# EAGLE design board (EAGLE 9.6.2)
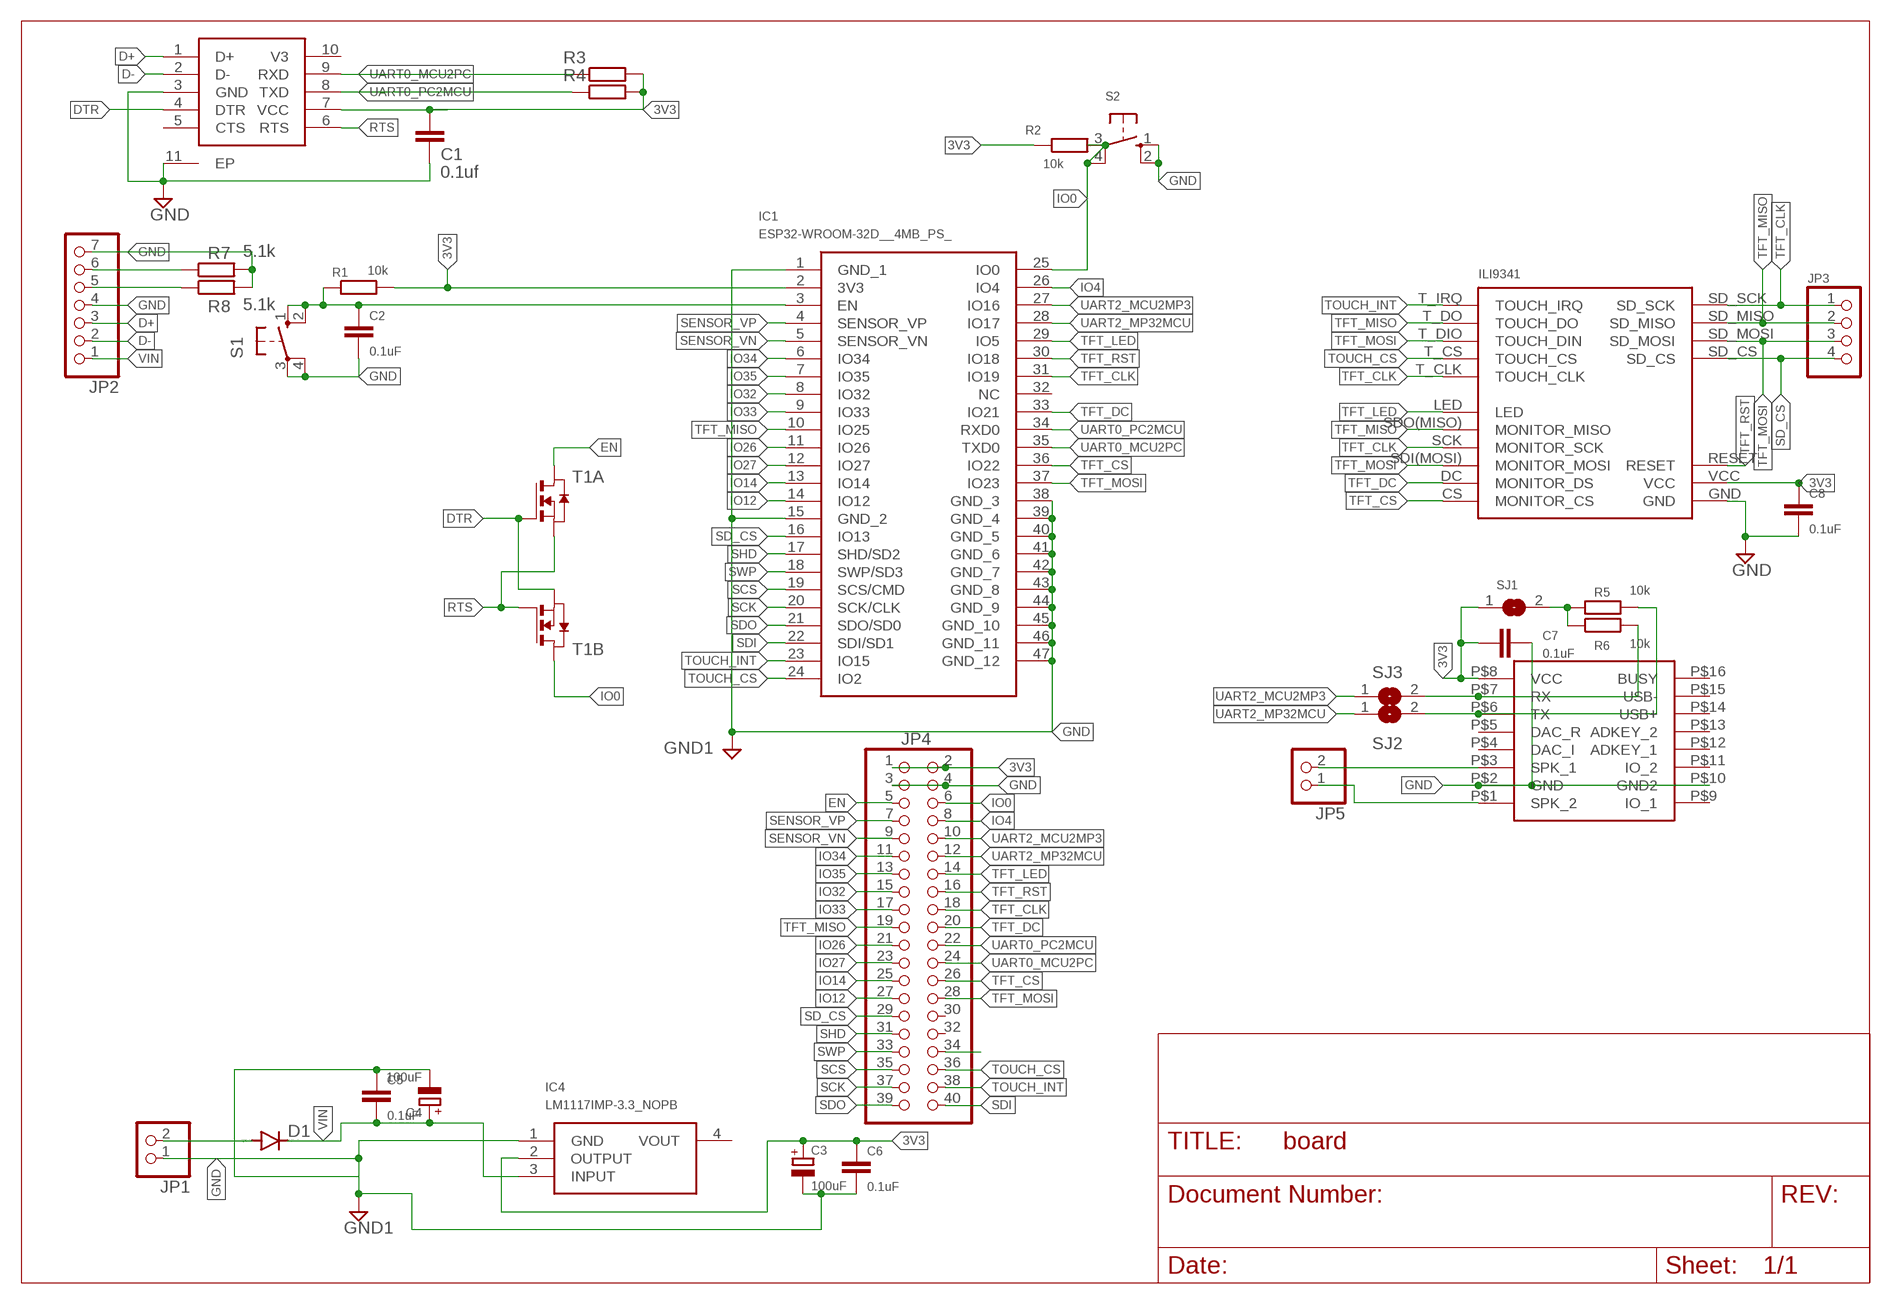
[diagram p0: schematic, sheet 1]

## Parts
C1  0.1uf  C-EUC1206  [C1206]
C2  0.1uF  C-EUC1206  [C1206]
C3  100uF  CPOL-EUE2.5-7  [E2,5-7]
C4  100uF  CPOL-EUE2.5-7  [E2,5-7]
C5  0.1uF  C-EUC1206  [C1206]
C6  0.1uF  C-EUC1206  [C1206]
C7  0.1uF  C-EUC1206  [C1206]
C8  0.1uF  C-EUC1206  [C1206]
D1  DIODE-SOD123  [SOD123]
IC1  ESP32-WROOM-32D__4MB_PS_  [ESP32WROOM32D4MBPS]
IC3  CH340K  [SOP100P600X150-11T240X280N]
IC4  LM1117IMP-3.3_NOPB  [SOT230P700X180-4N]
JP1  PINHD-1X2  [1X02]
JP2  PINHD-1X7  [1X07]
JP3  PINHD-1X4  [1X04]
JP4  PINHD-2X20  [2X20]
JP5  PINHD-1X2  [1X02]
R1  10k  R-EU_M1206  [M1206]
R2  10k  R-EU_M1206  [M1206]
R3  R-EU_M1206  [M1206]
R4  R-EU_M1206  [M1206]
R5  10k  R-EU_M1206  [M1206]
R6  10k  R-EU_M1206  [M1206]
R7  5.1k  R-EU_M1206  [M1206]
R8  5.1k  R-EU_M1206  [M1206]
S1  10-XX  [B3F-10XX]
S2  10-XX  [B3F-10XX]
SJ1  SJ  [SJ]
SJ2  SJ  [SJ]
SJ3  SJ  [SJ]
T1  NMOS2SO8  [SO8]
U$1  ILI9341_MODULE1  [ILI9341_MODULE1]
U$2  DFPLAYER_MINI  [DFPLAYER_MINI]

## Nets
3V3 [POWER]: C1.1 C3.+ C6.1 C7.1 C8.1 IC1.2(3V3) IC3.7(VCC) IC4.2(OUTPUT) JP4.1 JP4.2 R1.2 R2.1 R3.2 R4.2 SJ1.1 U$1.VCC U$2.P$8(VCC)
D+: IC3.1(D+) JP2.3
D-: IC3.2(D-) JP2.2
DTR: IC3.4(DTR) T1.2(A:G) T1.3(B:S)
EN: C2.1 IC1.3(EN) JP4.5 R1.1 S1.1(S) S1.2(S1) T1.7(A:D) T1.8(A:D)
GND [POWER]: C1.2 C2.2 C3.- C4.- C5.1 C6.2 C7.2 C8.2 IC1.1(GND_1) IC1.15(GND_2) IC1.38(GND_3) IC1.39(GND_4) IC1.40(GND_5) IC1.41(GND_6) IC1.42(GND_7) IC1.43(GND_8) IC1.44(GND_9) IC1.45(GND_10) IC1.46(GND_11) IC1.47(GND_12) IC3.3(GND) IC3.11(EP) IC4.1(GND) JP1.1 JP2.4 JP2.7 JP4.3 JP4.4 R7.2 R8.2 S1.3(P) S1.4(P1) S2.1(S) S2.2(S1) U$1.GND U$2.P$2(GND) U$2.P$10(GND2) ; supply symbol labelled GND1
IO0: IC1.25(IO0) JP4.6 JP4.34 R2.2 S2.3(P) S2.4(P1) T1.5(B:D) T1.6(B:D)
IO4: IC1.26(IO4) JP4.8
IO12: IC1.14(IO12) JP4.27
IO14: IC1.13(IO14) JP4.25
IO26: IC1.11(IO26) JP4.21
IO27: IC1.12(IO27) JP4.23
IO32: IC1.8(IO32) JP4.15
IO33: IC1.9(IO33) JP4.17
IO34: IC1.6(IO34) JP4.11
IO35: IC1.7(IO35) JP4.13
MP3_RX: R6.2 SJ3.2 U$2.P$7(RX)
MP3_TX: R5.2 SJ2.2 U$2.P$6(TX)
N$5: JP5.2 U$2.P$3(SPK_1)
N$6 [POWER]: D1.A JP1.2
N$7: JP2.6 R7.1
N$8: JP2.5 R8.1
N$9 [POWER]: R5.1 R6.1 SJ1.2
RTS: IC3.6(RTS) T1.1(A:S) T1.4(B:G)
SCK: IC1.20(SCK/CLK) JP4.37
SCS: IC1.19(SCS/CMD) JP4.35
SD_CS: IC1.16(IO13) JP3.4 JP4.29 U$1.SD_CS
SDI: IC1.22(SDI/SD1) JP4.40
SDO: IC1.21(SDO/SD0) JP4.39
SENSOR_VN: IC1.5(SENSOR_VN) JP4.9
SENSOR_VP: IC1.4(SENSOR_VP) JP4.7
SHD: IC1.17(SHD/SD2) JP4.31
SPK2: JP5.1 U$2.P$1(SPK_2)
SWP: IC1.18(SWP/SD3) JP4.33
TFT_CLK: IC1.31(IO19) JP3.1 JP4.18 U$1.SCK(MONITOR_SCK) U$1.SD_SCK U$1.T_CLK(TOUCH_CLK)
TFT_CS: IC1.36(IO22) JP4.26 U$1.CS(MONITOR_CS)
TFT_DC: IC1.33(IO21) JP4.20 U$1.DC(MONITOR_DS)
TFT_LED: IC1.29(IO5) JP4.14 U$1.LED
TFT_MISO: IC1.10(IO25) JP3.2 JP4.19 U$1.SD_MISO U$1.SDO(MISO)(MONITOR_MISO) U$1.T_DO(TOUCH_DO)
TFT_MOSI: IC1.37(IO23) JP3.3 JP4.28 U$1.SD_MOSI U$1.SDI(MOSI)(MONITOR_MOSI) U$1.T_DIO(TOUCH_DIN)
TFT_RST: IC1.30(IO18) JP4.16 U$1.RESET
TOUCH_CS: IC1.24(IO2) JP4.36 U$1.T_CS(TOUCH_CS)
TOUCH_INT: IC1.23(IO15) JP4.38 U$1.T_IRQ(TOUCH_IRQ)
UART0_MCU2PC: IC1.35(TXD0) IC3.9(RXD) JP4.24 R3.1
UART0_PC2MCU: IC1.34(RXD0) IC3.8(TXD) JP4.22 R4.1
UART2_MCU2MP3: IC1.27(IO16) JP4.10 SJ3.1
UART2_MP32MCU: IC1.28(IO17) JP4.12 SJ2.1
VIN [POWER]: C4.+ C5.2 D1.C IC4.3(INPUT) JP2.1
Unconnected: IC1.32(NC) IC3.5(CTS) IC3.10(V3) IC4.4(VOUT) JP4.30 JP4.32 U$2.P$4(DAC_I) U$2.P$5(DAC_R) U$2.P$9(IO_1) U$2.P$11(IO_2) U$2.P$12(ADKEY_1) U$2.P$13(ADKEY_2) U$2.P$14(USB+) U$2.P$15(USB-) U$2.P$16(BUSY)

## Library data of the parts
C1 C2 C5-C8 = rcl:C-EU: CAPACITOR, European symbol; SPICEPREFIX: C
C3 C4 = rcl:CPOL-EU: POLARIZED CAPACITOR, European symbol; SPICEPREFIX: C
D1 = diode:DIODE-: DIODE
IC1 = SamacSys_Parts:ESP32-WROOM-32D__4MB_PS_: WiFi Modules (802.11) Source: Datasheet; DESCRIPTION: WiFi Modules (802.11); HEIGHT: 3.2mm; MANUFACTURER_NAME: Espressif Systems; MANUFACTURER_PART_NUMBER: ESP32-WROOM-32D (4MB PS); MOUSER_PART_NUMBER: 356-ESPWROOM3200PS3; MOUSER_PRICE-STOCK: https://www.mouser.co.uk/ProductDetail/Espressif-Systems/ESP32-WROOM-32D-4MB-PS?qs=GBLSl2Akirs5uooPY1MBgw%3D%3D
IC3 = myparts:CH340K: USB-UART chip with DTR, CTS, RTS pin
IC4 = SamacSys_Parts:LM1117IMP-3.3_NOPB: LM1117IMP-3.3/NOPB, Low Dropout Voltage Regulator, 1.5A, 3.3 V +/-1%, 4-Pin SOT-223 Source: Datasheet <https://www.ti.com/lit/ds/symlink/lm1117.pdf?ts=1607578196475&ref_url=https%3A%2F%2Fwww.google.com%2F>; ARROW_PART_NUMBER: LM1117IMP-3.3/NOPB; ARROW_PRICE-STOCK: https://www.arrow.com/en/products/lm1117imp-3.3nopb/texas-instruments?region=nac; DESCRIPTION: LM1117IMP-3.3/NOPB, Low Dropout Voltage Regulator, 1.5A, 3.3 V +/-1%, 4-Pin SOT-223; HEIGHT: 1.8mm; MANUFACTURER_NAME: Texas Instruments; MANUFACTURER_PART_NUMBER: LM1117IMP-3.3/NOPB; MOUSER_PART_NUMBER: 926-LM1117IMP3.3NOPB; MOUSER_PRICE-STOCK: https://www.mouser.co.uk/ProductDetail/Texas-Instruments/LM1117IMP-33-NOPB?qs=X1J7HmVL2ZFbpN1TgOsjYQ%3D%3D
JP1 JP5 = pinhead:PINHD-1X2: PIN HEADER
JP2 = pinhead:PINHD-1X7: PIN HEADER
JP3 = pinhead:PINHD-1X4: PIN HEADER
JP4 = pinhead:PINHD-2X20: PIN HEADER
R1-R8 = rcl:R-EU_: RESISTOR, European symbol; SPICEPREFIX: R
S1 S2 = switch-omron:10-XX: OMRON SWITCH; MPN: B3F-1000; OC_FARNELL: 176432; OC_NEWARK: 36M3542
SJ1-SJ3 = jumper:SJ: SMD solder JUMPER
T1 = zetex:NMOS2: Dual MOS FET; OC_FARNELL: unknown; OC_NEWARK: unknown
U$1 = myparts:ILI9341_MODULE1
U$2 = myparts:DFPLAYER_MINI

## Net classes
0 default: width 0.254 mm, clearance 0.203 mm
1 POWER: width 0.762 mm, clearance 0.203 mm

## Board
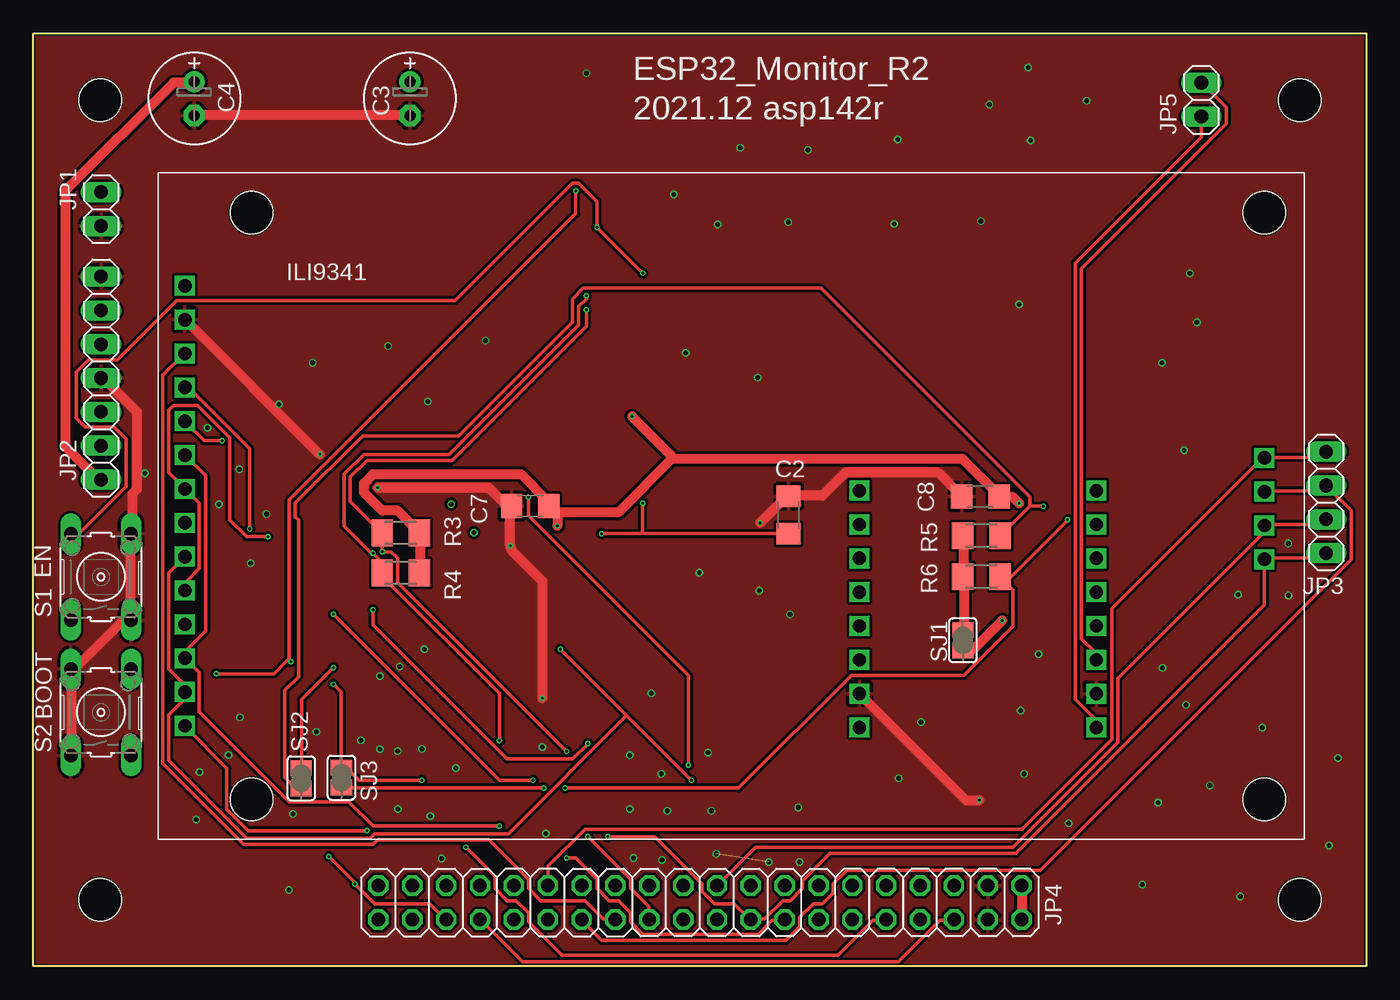
[diagram p1: board, top side]
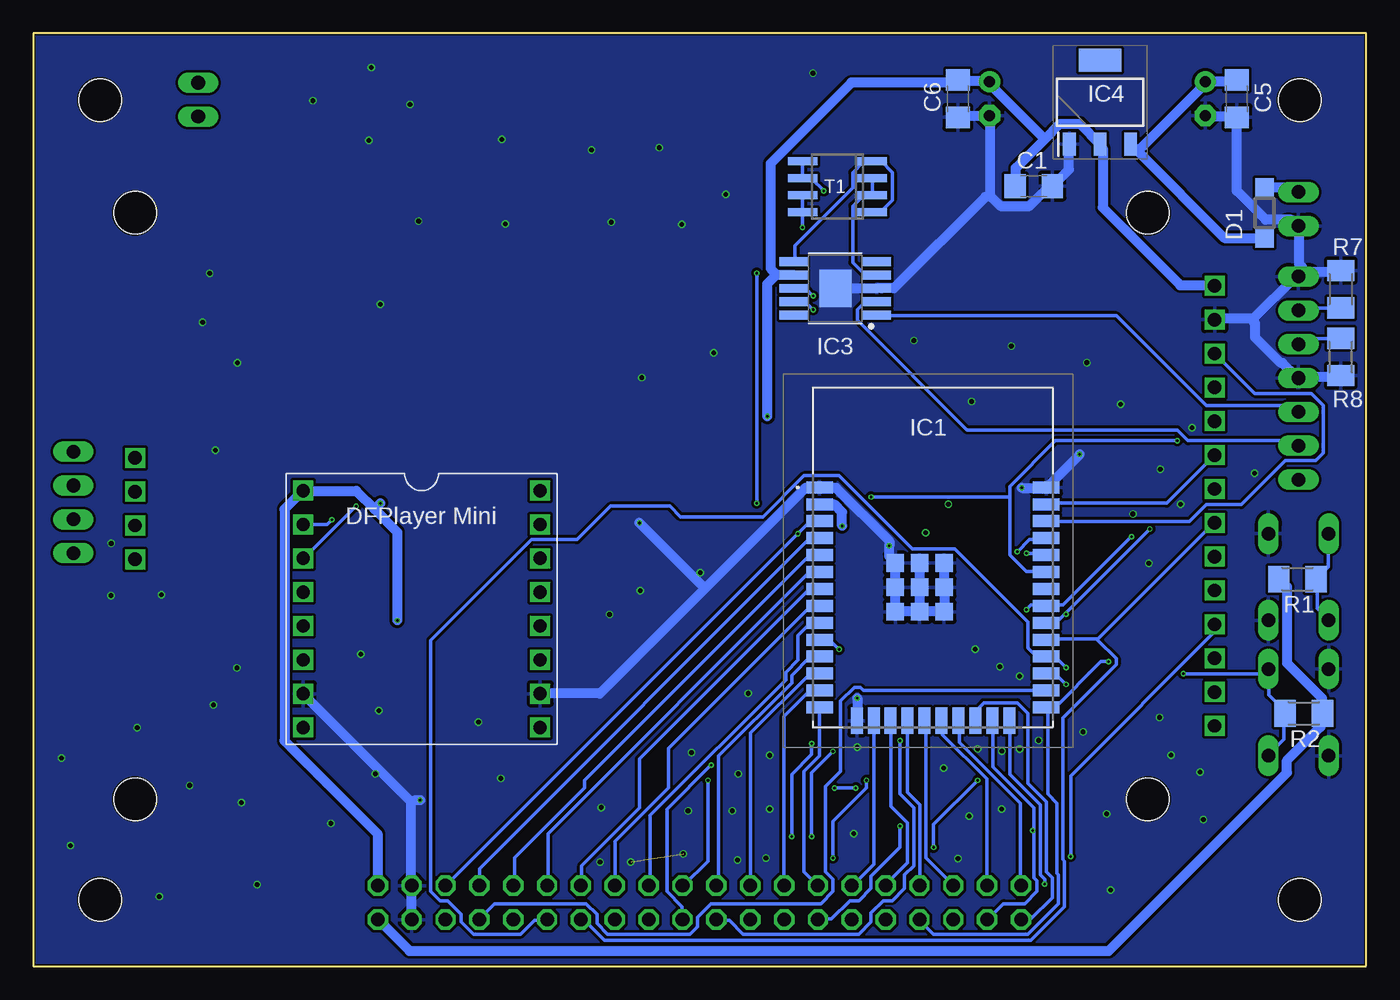
[diagram p2: board, bottom side, seen from below]

Size 100 x 70 mm. Coordinates in mm from the lower left corner, seen from the top.
Outline: 0,0 0,70 100,70 100,0 0,0
Copper layers (1*16): Top 0.035mm / dielectric 0.2mm / Bottom 0.035mm
Design rules "jlcpcb-2-layer": minimum track width 3.5mil, minimum drill 0.2mm, track to track 3.5mil, track to pad 5mil, pad to pad 5mil, via to via 5mil, smd to smd 0mil, copper to edge 0.1mm, drill to drill 5mil, minimum pad ring 4mil, minimum via ring 4mil, stop-mask expansion 3mil, vias tented up to drill 100mil, thermal gap 10mil
Holes 3.2 mm at 5,65 95,65 95,5 5,5

### Footprints (pad centres in the part's own frame; a part is rotated, then mirrored left to right if it is on the bottom)
C1206 = smd 1.6 x 1.8: 1 -1.4,0; 2 1.4,0
E2,5-7 = drill 0.813 pad 1.6: + -1.27,0 | drill 0.813 pad 1.6 octagon: - 1.27,0
SOD123 = smd 1.4 x 1.4: A 1.9,0; C -1.9,0
ESP32WROOM32D4MBPS = smd 2 x 0.9: 1 -8.5,5.26; 2 -8.5,3.99; 3 -8.5,2.72; 4 -8.5,1.45; 5 -8.5,0.18; 6 -8.5,-1.09; 7 -8.5,-2.36; 8 -8.5,-3.63; 9 -8.5,-4.9; 10 -8.5,-6.17; 11 -8.5,-7.44; 12 -8.5,-8.71; 13 -8.5,-9.98; 14 -8.5,-11.25; 25 8.5,-11.25; 26 8.5,-9.98; 27 8.5,-8.71; 28 8.5,-7.44; 29 8.5,-6.17; 30 8.5,-4.9; 31 8.5,-3.63; 32 8.5,-2.36; 33 8.5,-1.09; 34 8.5,0.18; 35 8.5,1.45; 36 8.5,2.72; 37 8.5,3.99; 38 8.5,5.26 | smd 0.9 x 2: 15 -5.715,-12.25; 16 -4.445,-12.25; 17 -3.175,-12.25; 18 -1.905,-12.25; 19 -0.635,-12.25; 20 0.635,-12.25; 21 1.905,-12.25; 22 3.175,-12.25; 23 4.445,-12.25; 24 5.715,-12.25 | smd 1.33 x 1.33: 39 -2.835,-0.405; 40 -1,-0.405; 41 0.835,-0.405; 42 0.835,-2.24; 43 -1,-2.24; 44 -2.835,-2.24; 45 -2.835,-4.075; 46 -1,-4.075; 47 0.835,-4.075
SOP100P600X150-11T240X280N = smd 2.097 x 0.672: 1 -3.119,2; 2 -3.119,1; 3 -3.119,0; 4 -3.119,-1; 5 -3.119,-2; 6 3.119,-2; 7 3.119,-1; 8 3.119,0; 9 3.119,1; 10 3.119,2 | smd 2.4 x 2.8: 11 0,0
SOT230P700X180-4N = smd 1.75 x 0.95: 1 -3.15,2.3; 2 -3.15,0; 3 -3.15,-2.3 | smd 1.75 x 3.2: 4 3.15,0
1X02 = drill 1.016 long: 1 -1.27,0; 2 1.27,0
1X07 = drill 1.016 long: 1 -7.62,0; 2 -5.08,0; 3 -2.54,0; 4 0,0; 5 2.54,0; 6 5.08,0; 7 7.62,0
1X04 = drill 1.016 long: 1 -3.81,0; 2 -1.27,0; 3 1.27,0; 4 3.81,0
2X20 = drill 1.016 octagon: 1 -24.13,-1.27; 2 -24.13,1.27; 3 -21.59,-1.27; 4 -21.59,1.27; 5 -19.05,-1.27; 6 -19.05,1.27; 7 -16.51,-1.27; 8 -16.51,1.27; 9 -13.97,-1.27; 10 -13.97,1.27; 11 -11.43,-1.27; 12 -11.43,1.27; 13 -8.89,-1.27; 14 -8.89,1.27; 15 -6.35,-1.27; 16 -6.35,1.27; 17 -3.81,-1.27; 18 -3.81,1.27; 19 -1.27,-1.27; 20 -1.27,1.27; 21 1.27,-1.27; 22 1.27,1.27; 23 3.81,-1.27; 24 3.81,1.27; 25 6.35,-1.27; 26 6.35,1.27; 27 8.89,-1.27; 28 8.89,1.27; 29 11.43,-1.27; 30 11.43,1.27; 31 13.97,-1.27; 32 13.97,1.27; 33 16.51,-1.27; 34 16.51,1.27; 35 19.05,-1.27; 36 19.05,1.27; 37 21.59,-1.27; 38 21.59,1.27; 39 24.13,-1.27; 40 24.13,1.27
M1206 = smd 1.6 x 2: 1 -1.4,0; 2 1.4,0
B3F-10XX = drill 1.016 long: 1 -3.251,2.261; 2 3.251,2.261; 3 -3.251,-2.261; 4 3.251,-2.261
SJ = smd 1.168 x 1.6: 1 -0.762,0; 2 0.762,0
SO8 = smd 0.6 x 2.2: 1 -1.905,-2.6; 2 -0.635,-2.6; 3 0.635,-2.6; 4 1.905,-2.6; 5 1.905,2.6; 6 0.635,2.6; 7 -0.635,2.6; 8 -1.905,2.6
ILI9341_MODULE1 = drill 1 square: CS 2,36.44; DC 2,31.36; GND 2,38.98; LED 2,23.74; RESET 2,33.9; SCK 2,26.28; SD_CS 83,28.62; SD_MISO 83,23.54; SD_MOSI 83,26.08; SD_SCK 83,21; SDI(MOSI) 2,28.82; SDO(MISO) 2,21.2; T_CLK 2,18.66; T_CS 2,16.12; T_DIO 2,13.58; T_DO 2,11.04; T_IRQ 2,8.5; VCC 2,41.52 | hole 3.2: 7,3; 7,47; 83,47; 83,3
DFPLAYER_MINI = drill 1 square: P$1 0,0; P$2 0,2.54; P$3 0,5.08; P$4 0,7.62; P$5 0,10.16; P$6 0,12.7; P$7 0,15.24; P$8 0,17.78; P$9 17.78,0; P$10 17.78,2.54; P$11 17.78,5.08; P$12 17.78,7.62; P$13 17.78,10.16; P$14 17.78,12.7; P$15 17.78,15.24; P$16 17.78,17.78

### Placement (x,y rotation side)
C1  24.94,58.55 0 bottom
C2  56.67,33.86 90 top
C3  28.26,65.09 270 top
C4  12.07,65.09 270 top
C5  9.69,65.09 90 bottom
C6  30.64,65.09 270 bottom
C7  37.28,34.53 180 top
C8  71.06,35.23 180 top
D1  7.62,56.52 90 bottom
IC1  32.5,30.67 0 bottom
IC3  39.83,50.86 180 bottom
IC4  19.97,64.83 90 bottom
JP1  5.08,56.82 90 top
JP2  5.08,44.13 90 top
JP3  97,34.8 90 top
JP4  50.02,4.77 180 top
JP5  87.63,65.02 90 top
R1  5.16,29.05 180 bottom
R2  4.68,18.96 180 bottom
R3  27.57,32.51 0 top
R4  27.57,29.51 0 top
R5  71.13,32.29 0 top
R6  71.13,29.21 0 top
R7  1.91,50.8 90 bottom
R8  1.91,45.72 270 bottom
S1  5.08,29.21 90 top
S2  5.08,19.05 90 top
SJ1  69.74,24.46 90 top
SJ2  20.09,14.1 270 top
SJ3  23.11,14.15 270 top
T1  39.67,58.48 90 bottom
U$1  9.37,9.53 0 top
U$2  79.76,17.91 0 bottom

### Tracks (layer width: path | path; a pad name or v marks a point on that pad's centre or on a via)
3V3  (via drill 0.2)
  Top 0.762: R4.2 29.03,29.6 29.03,32.12 R3.2 28.92,32.58 27.32,34.18 26.18,34.18 24.8,35.55 24.8,36.23 25.49,36.92 36.58,36.92 38.63,34.86 38.63,34.63 C7.1 38.98,34.29 39.32,33.95 | 39.32,33.95 v39.32,33.03 | JP4.2 74.18,3.54 74.18,5.94 JP4.1 | v72.69,25.95 70.52,23.77 69.84,23.77 SJ1.1 | v73.95,34.75 73.5,35.2 72.47,35.2 C8.1 72.24,35.55 69.72,38.06 47.89,38.06 | 47.89,38.06 43.89,34.06 39.66,34.06 39.32,33.95 | v44.92,41.26 47.78,38.41 47.89,38.06
  Bottom 0.762: 24.12,62.06 26.29,59.89 26.29,58.64 C1.1 | 24.12,62.06 22.97,63.21 21.49,63.21 20,61.72 IC4.2 19.77,61.38 19.77,56.92 13.95,51.09 11.43,51.09 U$1.VCC | 44.23,51.89 42.98,51.89 IC3.7 | 44.23,51.89 44.69,52.35 44.69,60.24 38.63,66.29 30.98,66.29 C6.1 30.63,66.41 28.35,66.41 C3.+ 28.12,66.06 24.12,62.06 | v39.32,33.03 39.32,34.06 39.89,34.63 40.92,34.63 IC1.2 | R1.2 6.51,29.03 5.94,28.46 5.94,22.75 3.31,20.12 3.31,18.97 R2.1 3.43,18.63 3.43,17.95 5.94,15.43 5.94,14.52 19.32,1.14 71.78,1.14 74.07,3.43 JP4.2 | v72.69,25.95 72.69,32.58 74.41,34.29 | 74.41,34.29 75.78,35.66 79.67,35.66 U$2.P$8 81.15,34.29 81.15,16.92 74.18,9.94 74.18,6.06 JP4.1 | v73.95,34.75 74.41,34.29 | 44.23,51.89 44.92,51.21 v44.92,41.26
D+
  Bottom 0.254: IC3.1 36.69,48.81 18.75,48.81 12,42.06 5.6,42.06 5.14,41.6 JP2.3
D-
  Bottom 0.254: IC3.2 36.8,49.84 37.6,49.84 38.18,49.26 38.18,48.46 29.95,40.23 14.17,40.23 13.37,39.43 5.49,39.43 5.14,39.09 JP2.2
DTR
  Bottom 0.254: IC3.4 36.8,51.89 37.6,51.89 38.52,52.81 38.52,57.04 37.72,57.84 37.15,57.84 T1.2 37.03,57.95 37.03,59.09 T1.3
EN  (via drill 0.2)
  Top 0.254: v42.63,32.46 45.72,32.46 | 45.72,32.46 56.58,32.46 C2.1 | v45.72,52.01 v42.29,55.44 42.29,57.38 40.92,58.75 40.46,58.75 31.66,49.95 10.74,49.95 6.29,45.49 4.12,45.49 3.2,44.58 3.2,41.15 3.89,40.46 6.06,40.46 6.97,39.55 6.97,36.01 3.43,32.46 S1.2 | 45.72,32.46 v45.72,34.75
  Bottom 0.254: S1.1 2.86,26.06 3.66,26.86 3.66,29.03 R1.1 3.66,29.15 2.86,29.95 2.86,32.46 S1.2 | T1.7 42.29,57.84 42.29,56.69 T1.8 42.29,56.46 v42.29,55.44 | IC1.3 41.03,33.38 41.72,33.38 v42.63,32.46 69.04,6.06 JP4.5 | v45.72,34.75 v45.72,52.01
GND  (via drill 0.2, 0.35)  (1 unrouted)
  Top 0.762: S2.1 2.86,15.89 2.86,22.29 S2.2 3.2,22.4 6.74,25.95 7.32,25.95 S1.3 7.32,26.29 7.32,32.46 S1.4 7.43,32.8 7.43,35.43 7.77,35.78 7.77,41.6 5.14,44.23 JP2.4 | C3.- 28.23,63.89 12.12,63.89 C4.- | C8.2 69.61,35.32 67.89,37.03 60.92,37.03 59.21,35.32 56.69,35.32 C2.2 56.35,35.09 v54.52,33.26 | v38.18,20.12 38.18,28.92 35.89,31.2 v35.78,31.55 35.78,34.52 C7.2 35.43,34.63 34.18,35.89 v25.83,35.89 | v70.98,12.46 69.95,12.46 62.06,20.34 U$2.P$10 | v21.49,38.41 11.43,48.46 U$1.GND
  Bottom 0.762: IC3.11 39.78,50.86 36.8,50.86 IC3.3 36.35,50.86 35.43,50.86 28.57,57.72 28.23,57.84 | IC4.1 22.29,61.61 22.29,59.78 23.43,58.64 C1.2 23.89,58.41 25.26,57.04 27.43,57.04 28.23,57.84 | C6.2 30.63,63.78 28.35,63.78 C3.- 28.23,63.44 28.23,57.84 | R8.2 1.94,44.23 5.03,44.23 JP2.4 5.37,44.35 6.29,45.26 6.4,45.26 8.34,47.21 8.34,48.23 8.46,48.58 | C4.- 12,63.78 9.72,63.78 C5.1 9.72,63.32 9.72,58.18 7.54,56.01 5.6,56.01 5.37,55.78 JP1.1 5.03,55.55 5.03,52.69 4.8,52.46 JP2.7 | R7.2 1.94,52.12 4.69,52.12 5.03,51.78 JP2.7 | 8.46,48.58 11.32,48.58 U$1.GND | 8.46,48.58 5.37,51.66 JP2.7 | 71.67,12.34 79.67,20.34 U$2.P$2 | 71.67,12.34 71.67,6.06 JP4.3 71.67,5.71 71.67,3.54 JP4.4 | IC1.41 31.66,30.18 31.66,28.8 IC1.42 31.66,28.35 31.66,26.63 IC1.47 32,26.63 33.49,26.63 IC1.46 | IC1.46 33.49,26.98 33.49,28.35 IC1.43 33.49,28.8 33.49,30.18 IC1.40 | IC1.46 33.83,26.63 35.32,26.63 IC1.45 35.32,26.98 35.32,28.35 IC1.44 35.32,28.8 35.32,30.18 IC1.39 35.55,30.52 35.78,30.75 v35.78,31.55 35.78,31.89 39.78,35.89 40.92,35.89 IC1.1 41.38,35.89 42.06,35.89 49.61,28.35 | v38.18,20.12 38.18,18.52 IC1.15 | v25.83,35.89 24,35.89 IC1.38 23.77,36.12 v21.49,38.41 | 49.61,28.35 57.49,20.46 61.95,20.46 U$2.P$10 | 49.61,28.35 v54.52,33.26 | v70.98,12.46 71.32,12.46 71.67,12.34
  other vias: 19.18,5.71 12.22,11 15.49,18.67 30.63,8.08 38.46,9.96 16.31,30.23 18.41,42.16 20.95,45.29 26.62,46.53 33.93,46.94 29.59,42.37 54.36,44.17 48.95,46.02 50.88,11.66 47.57,11.66 44.75,11.79 57.38,11.91 50.62,16.03 17.5,33.93 13.92,34.67 8.38,36.98 94.16,31.72 90.4,27.86 94.18,27.81 84.73,22.38 86.49,19.61 77.67,10.72 51.23,8.43 47.17,7.95 45.03,8.1 44.75,15.82 47.12,14.43 46.35,20.47 29.34,23.8 27.48,22.48 29.79,11.25 27.36,11.79 21.23,17.58 26.01,21.77 19.48,11.43 12.47,14.55 14.63,15.85 24.59,16.94 26.01,16.28 27.33,16.13 29.16,16.31 31.7,14.86 38.18,16.43 13.06,40.41 15.44,37.29 57.48,7.82 55.17,7.82 84.38,12.27 88.27,13.56 92.2,17.91 97.89,15.62 97.21,9.04 90.55,5.23 83.21,6.12 41.5,67.01 48.06,57.91 51.36,55.65 53.04,61.42 56.64,55.83 58.12,61.24 64.59,55.7 64.85,62.03 71.73,64.67 74.63,67.44 79.02,64.95 74.83,61.95 71.09,55.91 73.96,49.66 86.77,51.99 87.3,48.31 84.68,45.26 86.33,38.71 56.77,26.39 54.46,28.17 49.96,29.51 64.92,14.1 66.6,18.31 74.07,19.18 74.35,14.43 75.41,23.42
  pour Top: 2.74,73.08 0.81,73.08 -3.86,68.4 -3.86,1.63 1.02,-3.25 97.92,-3.25 105.13,3.96 105.13,66.88 98.53,73.48
  pour Bottom: 0.71,74.9 -6.6,67.59 -6.6,66.47 -6.6,3.15 1.83,-5.28 98.12,-5.28 106.65,3.25 106.65,67.18 98.63,75.21 98.02,75.82 38.76,75.82
IO0  (via drill 0.2)
  Top 0.254: v40.69,58.18 40.69,56.46 19.2,34.98 19.2,22.97 | v19.32,22.86 19.2,22.97 | JP4.6 69.04,3.43 68.01,3.43 64.92,0.34 36.69,0.34 33.6,3.43 JP4.34 | v13.72,21.95 18.06,21.95 19.09,22.97 19.2,22.97
  Bottom 0.254: S2.3 7.32,15.89 6.17,17.03 6.17,18.86 R2.2 6.06,19.09 7.32,20.34 7.32,22.29 S2.4 7.43,21.95 v13.72,21.95 | T1.5 42.29,60.35 42.29,59.21 T1.6 42.18,59.09 41.6,59.09 v40.69,58.18 | JP4.34 33.49,3.43 32.46,2.4 25.38,2.4 23.09,4.69 23.09,6.86 23.2,6.97 23.2,12.23 23.89,12.92 23.89,19.32 IC1.25 23.77,19.32 23.43,19.32 19.89,22.86 v19.32,22.86
IO4
  Bottom 0.254: IC1.26 37.72,20.69 37.95,20.92 38.41,20.92 39.43,19.89 39.43,14.63 40.58,13.49 40.58,7.09 40.01,6.51 40.01,5.6 40.92,4.69 49.15,4.69 50.18,3.66 50.18,2.97 50.75,2.4 56.92,2.4 57.72,3.2 57.72,3.89 58.52,4.69 65.38,4.69 66.52,3.54 JP4.8
IO12
  Bottom 0.254: IC1.14 41.03,19.32 41.03,15.77 42.18,14.63 42.18,7.09 41.15,6.06 JP4.27
IO14
  Bottom 0.254: IC1.13 41.03,20.57 41.83,20.57 43.66,18.75 43.66,6.06 JP4.25
IO26
  Bottom 0.254: IC1.11 41.03,23.2 41.72,23.2 43.09,21.83 43.09,21.26 48.58,15.77 48.58,6.17 48.69,6.06 JP4.21
IO27
  Bottom 0.254: IC1.12 41.03,21.95 41.72,21.95 46.18,17.49 46.18,6.06 JP4.23
IO32
  Bottom 0.254: IC1.8 41.03,26.98 41.72,26.98 52.35,16.34 52.35,13.37 56.35,9.37 56.35,6.06 JP4.15
IO33
  Bottom 0.254: IC1.9 41.03,25.72 41.72,25.72 42.63,24.8 42.63,22.97 43.55,22.06 43.55,21.49 53.72,11.32 53.72,6.06 JP4.17
IO34
  Bottom 0.254: IC1.6 41.03,29.49 41.83,29.49 61.38,9.94 61.38,6.06 JP4.11
IO35
  Bottom 0.254: IC1.7 41.03,28.23 41.83,28.23 54.52,15.54 54.52,11.89 58.86,7.54 58.86,6.06 JP4.13
MP3_RX  (via drill 0.2)
  Top 0.254: v38.29,13.37 23.2,13.37 SJ3.2 | v39.89,13.37 52.92,13.37 61.38,21.83 69.84,21.83 73.5,25.49 73.5,28.23 72.92,28.8 | 72.92,28.8 72.58,29.15 R6.2 72.92,28.8 | 72.92,28.8 v77.61,33.49
  Bottom 0.254: v39.89,13.37 v38.29,13.37 | U$2.P$7 77.95,33.15 v77.61,33.49
MP3_TX  (via drill 0.2)
  Top 0.254: 74.75,34.52 74.75,35.2 59.09,50.86 41.26,50.86 40.46,50.06 40.46,48.35 31.89,39.78 24.69,39.78 19.66,34.75 19.66,33.72 19.89,33.49 19.89,21.72 18.86,20.69 18.86,14.17 19.66,13.37 20,13.37 SJ2.2 | 74.75,34.52 72.58,32.35 R5.2 | 74.75,34.52 v75.78,34.52
  Bottom 0.254: v75.78,34.52 79.67,30.63 U$2.P$6
N$1  (via drill 0.35)
  other vias: 33.05,32.54
N$2  (via drill 0.35)
  other vias: 31.34,34.67
N$5
  Top 0.254: U$2.P$3 79.67,23.09 79.67,23.55 78.64,24.57 78.64,52.35 89.5,63.21 89.5,64.47 87.67,66.29 JP5.2
N$6
  Bottom 0.762: D1.A 7.54,58.41 5.37,58.41 5.14,58.18 JP1.2
N$7
  Bottom 0.254: R7.1 1.94,49.38 4.92,49.38 5.03,49.26 JP2.6
N$8
  Bottom 0.254: R8.1 1.94,47.09 4.69,47.09 5.03,46.75 JP2.5
N$9
  Top 0.762: SJ1.2 69.84,25.26 69.84,29.15 R6.1 69.84,29.49 69.84,32.23 R5.1
RTS
  Bottom 0.254: IC3.6 42.86,52.92 42.86,54.06 38.52,58.41 38.52,59.55 37.72,60.35 37.15,60.35 T1.4 37.03,60.35 36.35,60.35 35.55,59.55 35.55,57.49 36.35,56.69 37.03,56.69 T1.1
SCK
  Bottom 0.254: IC1.20 31.77,18.4 31.77,17.37 28.46,14.06 28.46,6.06 JP4.37
SCS
  Bottom 0.254: IC1.19 33.03,18.4 33.03,8.12 30.98,6.06 JP4.35
SD_CS
  Top 0.254: JP3.4 96.93,38.52 96.58,38.18 92.47,38.18 U$1.SD_CS 92.24,38.18 80.92,26.86 80.92,17.03 74.18,10.29 41.38,10.29 38.63,7.54 38.63,6.06 JP4.29
  Bottom 0.254: IC1.16 36.92,18.4 36.92,7.66 38.52,6.06 JP4.29
SDI
  Bottom 0.254: IC1.22 29.26,18.52 29.26,19.2 28.69,19.77 26.18,19.77 25.38,18.97 25.38,13.72 24,12.34 24,7.09 23.55,6.63 23.55,5.14 25.15,3.54 25.83,3.54 JP4.40
SDO
  Bottom 0.254: IC1.21 30.52,18.4 30.52,16.8 25.95,12.23 25.95,6.06 JP4.39
SENSOR_VN
  Bottom 0.254: IC1.5 41.03,30.75 41.83,30.75 58.64,13.95 58.64,13.37 63.89,8.12 63.89,6.06 JP4.9
SENSOR_VP
  Bottom 0.254: IC1.4 41.03,32 41.83,32 66.52,7.32 66.52,6.06 JP4.7
SHD
  Bottom 0.254: IC1.17 35.66,18.4 35.66,12 34.4,10.74 34.4,7.77 36.12,6.06 JP4.31
SPK2
  Top 0.254: U$2.P$1 79.67,17.95 79.67,18.52 78.18,20 78.18,52.77 87.63,62.22 JP5.1
SWP
  Bottom 0.254: IC1.18 34.4,18.4 34.4,13.03 33.49,12.12 33.49,6.06 JP4.33
TFT_CLK  (via drill 0.2)
  Top 0.254: v17.6,32.23 16,32.23 14.74,33.49 14.74,39.66 12.34,42.06 10.52,42.06 10.17,41.72 10.17,37.03 11.32,35.89 U$1.SCK 11.43,35.78 12.46,34.75 12.46,29.83 11.43,28.8 11.43,28.23 U$1.T_CLK | JP3.1 96.93,30.98 96.58,30.63 92.47,30.63 U$1.SD_SCK 92.35,30.4 92.35,27.09 73.72,8.46 59.78,8.46 57.72,6.4 57.72,5.83 56.81,4.92 56.24,4.92 54.86,3.54 53.84,3.54 JP4.18 53.72,3.54 52.58,4.69 51.09,4.69 50.18,5.6 50.18,6.17 46.63,9.72 v43.09,9.72 | v25.49,26.75 25.49,25.6 35.55,15.54 40.46,15.54 v41.6,16.69
  Bottom 0.254: v17.6,32.23 22.75,27.09 23.89,27.09 IC1.31 24.12,27.09 25.15,27.09 v25.49,26.75 | v41.6,16.69 41.6,15.89 43.09,14.4 v43.09,9.72
TFT_CS
  Top 0.254: JP4.26 43.66,3.54 42.75,3.54 41.38,4.92 38.06,4.92 37.15,5.83 37.15,6.51 34.18,9.49 25.83,9.49 25.49,9.14 15.77,9.14 9.72,15.2 9.72,44.35 11.32,45.95 U$1.CS
  Bottom 0.254: IC1.36 23.89,33.38 13.26,33.38 12,34.63 9.37,34.63 6.06,37.95 3.77,37.95 3.2,38.52 3.2,42.06 4.12,42.98 8.34,42.98 11.32,45.95 U$1.CS
TFT_DC  (via drill 0.2)
  Top 0.254: v14.17,39.43 12.8,39.43 11.43,40.8 U$1.DC | v49.15,15.09 49.15,21.83 37.15,33.83 v37.15,35.2
  Bottom 0.254: 26.75,35.2 26.75,36.01 23.32,39.43 v14.17,39.43 | 26.75,35.2 26.75,30.86 25.49,29.6 24,29.6 IC1.33 | v49.15,15.09 52.46,11.77 52.46,5.6 51.32,4.46 51.32,3.54 JP4.20 | 26.75,35.2 v37.15,35.2
TFT_LED
  Bottom 0.254: 20.12,24.57 23.89,24.57 IC1.29 | 20.12,24.57 11.43,33.26 U$1.LED | JP4.14 58.86,3.43 58.64,3.43 57.15,1.94 25.15,1.94 22.63,4.46 22.63,7.89 22.75,8 22.75,18.63 18.75,22.63 18.75,23.09 20.12,24.46 20.12,24.57
TFT_MISO  (via drill 0.2)
  Top 0.254: U$1.SDO(MISO) 11.32,30.63 10.17,29.49 10.17,22.29 11.32,21.14 11.32,20.57 U$1.T_DO 11.32,20.46 11.32,20 10.17,18.86 10.17,15.43 16,9.6 25.26,9.6 25.6,9.94 35.66,9.94 44.52,18.8 | JP3.2 96.93,33.49 96.58,33.15 92.47,33.15 U$1.SD_MISO 92.24,33.03 92.24,32.46 81.38,21.6 81.38,16.8 73.5,8.91 54.18,8.91 51.32,6.06 JP4.19 | v49.38,13.95 44.52,18.8 | 44.52,18.8 v39.55,23.77
  Bottom 0.254: v39.55,23.77 40.23,24.46 40.92,24.46 IC1.10 | v49.38,13.95 49.38,7.89 51.21,6.06 JP4.19
TFT_MOSI  (via drill 0.2)
  Top 0.254: U$1.SD_MOSI 92.47,35.66 96.58,35.66 96.93,36.01 JP3.3 97.04,36.01 98.87,34.18 98.87,30.52 75.55,7.2 61.04,7.2 60.01,6.17 60.01,5.49 59.21,4.69 58.52,4.69 57.49,3.66 57.49,2.97 56.46,1.94 42.63,1.94 41.15,3.43 JP4.28 | U$1.SDI(MOSI) 11.43,38.29 12.92,36.8 12.92,25.15 11.43,23.66 11.43,23.2 U$1.T_DIO 11.43,23.09 12.46,22.06 12.46,19.09 19.2,12.34 23.66,12.34 25.49,10.52 v34.98,10.52
  Bottom 0.254: IC1.37 23.89,34.75 14.97,34.75 11.43,38.29 U$1.SDI(MOSI) | v34.98,10.52 34.98,8.91 37.15,6.74 37.15,5.83 38.06,4.92 38.75,4.92 40.12,3.54 41.03,3.54 JP4.28
TFT_RST  (via drill 0.2)
  Top 0.254: v16.23,32.8 16.23,38.86 11.77,43.32 11.43,43.32 U$1.RESET | v40.01,8.12 40.69,8.12 42.29,6.51 42.29,5.83 43.2,4.92 43.89,4.92 44.81,4 44.81,3.31 45.72,2.4 54.41,2.4 55.44,3.43 56.35,3.43 JP4.16 | v37.49,13.95 34.98,13.95 v22.52,26.4
  Bottom 0.254: v16.23,32.8 22.57,26.46 | 22.57,26.46 23.2,25.83 23.89,25.83 IC1.30 | v40.01,8.12 40.01,10.86 37.49,13.37 v37.49,13.95 | v22.52,26.4 22.57,26.46
TOUCH_CS  (via drill 0.2)
  Top 0.254: JP4.36 30.86,3.54 29.72,4.69 25.6,4.69 v24.12,6.17 24.12,6.29 v22.17,8.23
  Bottom 0.254: v24.12,6.17 24.12,6.51 24.46,6.86 24.46,12.12 26.75,14.4 26.75,18.4 IC1.24 | v22.17,8.23 22.17,14.29 11.43,25.03 11.43,25.6 U$1.T_CS
TOUCH_INT  (via drill 0.2)
  Top 0.254: v25.03,10.17 16.12,10.17 14.52,11.77 14.52,14.86 11.43,17.95 U$1.T_IRQ
  Bottom 0.254: 24.92,10.17 24.92,6.63 24.69,6.4 24.69,5.6 25.6,4.69 27.2,4.69 28.35,3.54 JP4.38 | 24.92,10.17 24.92,11.89 28,14.97 28,18.4 IC1.23 | v25.03,10.17 24.92,10.17
UART0_MCU2PC  (via drill 0.2)
  Top 0.254: v41.49,49.26 41.49,48.03 31.41,37.95 25.03,37.95 23.77,36.69 23.77,34.86 26.06,32.58 R3.1 26.18,32.46 v26.18,31.09 26.86,31.09 27.32,30.63 27.32,28.8 v40.01,16.12 | v41.6,9.72 44.81,6.51 44.81,5.83 46.18,4.46 46.18,3.54 JP4.24
  Bottom 0.254: v26.18,31.09 25.26,32 24,32 IC1.35 | v41.49,49.26 42.06,49.84 42.86,49.84 IC3.9 | v41.6,9.72 41.6,14.52 v40.01,16.12
UART0_PC2MCU  (via drill 0.2)
  Top 0.254: v41.49,50.29 41.49,50.06 40.92,49.49 40.92,48.12 31.2,38.41 24.8,38.41 23.32,36.92 23.32,33.03 25.38,30.98 v25.49,30.98 26.06,30.4 26.06,29.6 R4.1 26.29,29.49 26.29,29.15 34.98,20.46 v34.98,16.92
  Bottom 0.254: v25.49,30.98 24.12,30.98 24,30.86 IC1.34 | v41.49,50.29 42.06,50.86 42.86,50.86 IC3.8 | v34.98,16.92 34.98,12.92 33.95,11.89 33.95,7.54 34.63,6.86 34.63,5.83 35.55,4.92 36.23,4.92 37.15,4 37.15,3.31 38.06,2.4 46.75,2.4 47.78,3.43 48.69,3.43 JP4.22
UART2_MCU2MP3  (via drill 0.2)
  Top 0.254: v22.52,21.14 23.09,20.57 23.09,14.97 SJ3.1 23.2,14.86 23.55,14.86 24.46,13.95 v29.15,13.95 | v32.46,8.91 34.63,6.74 34.63,5.83 35.55,4.92 36.23,4.92 37.15,4 37.15,3.31 39.66,0.8 60.35,0.8 62.98,3.43 63.89,3.43 JP4.10
  Bottom 0.254: v22.52,21.14 23.32,21.95 23.89,21.95 IC1.27 | v32.46,8.91 32.46,10.63 v29.15,13.95
UART2_MP32MCU  (via drill 0.2)
  Top 0.254: v22.52,22.4 20.12,20 20.12,14.86 SJ2.1
  Bottom 0.254: v22.52,22.4 23.32,23.2 23.89,23.2 IC1.28 24.12,23.2 24.69,23.2 25.38,23.89 25.38,25.83 30.86,31.32 34.06,31.32 39.55,36.8 42.18,36.8 45.26,33.72 51.44,33.72 52.23,34.52 56.69,34.52 59.21,32 62.64,32 70.18,24.46 70.18,5.6 69.49,4.92 68.92,4.92 67.89,3.89 67.89,3.31 66.98,2.4 63.44,2.4 62.41,3.43 61.49,3.43 JP4.12
VIN
  Top 0.762: JP2.1 5.03,36.58 4.8,36.58 2.4,38.98 2.4,58.18 10.52,66.29 12,66.29 C4.+
  Bottom 0.762: 17.14,61.15 17.6,61.61 IC4.3 | 17.14,61.15 10.63,54.63 7.66,54.63 D1.C | C5.2 9.72,66.41 12,66.41 C4.+ 12.23,66.06 17.14,61.15

### Text on the board
tPlace: ESP32_Monitor_R2 | 2021.12 asp142r
tNames: EN | BOOT